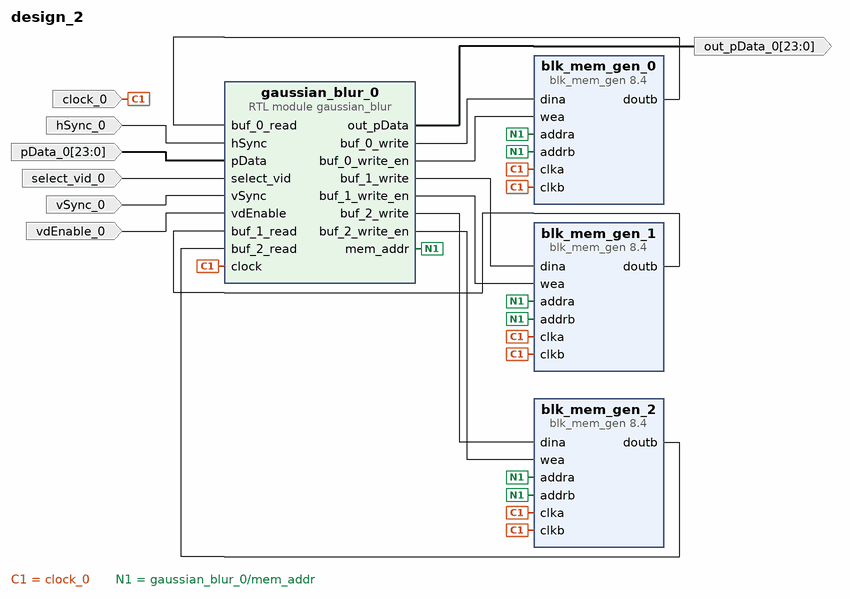
[diagram p0: block diagram of the top level]
# Vivado block design design_2, xc7z020clg400-1, Vivado 2021.2
create_bd_design design_2

create_bd_port -dir I hSync_0
create_bd_port -dir I vSync_0
create_bd_port -dir I vdEnable_0
create_bd_port -dir I -from 23 -to 0 pData_0
create_bd_port -dir O -from 23 -to 0 out_pData_0
create_bd_port -dir I -type clk clock_0
create_bd_port -dir I select_vid_0

create_bd_cell -type ip -vlnv xilinx.com:ip:blk_mem_gen:8.4 blk_mem_gen_0
set_property -dict [list \
  CONFIG.Enable_32bit_Address false \
  CONFIG.Enable_A Always_Enabled \
  CONFIG.Enable_B Always_Enabled \
  CONFIG.Memory_Type Simple_Dual_Port_RAM \
  CONFIG.Operating_Mode_A WRITE_FIRST \
  CONFIG.Port_B_Clock 100 \
  CONFIG.Port_B_Enable_Rate 100 \
  CONFIG.Read_Width_B 24 \
  CONFIG.Register_PortB_Output_of_Memory_Primitives true \
  CONFIG.Use_Byte_Write_Enable false \
  CONFIG.Write_Depth_A 2040 \
  CONFIG.Write_Width_A 24 \
  CONFIG.Write_Width_B 24 \
  CONFIG.use_bram_block Stand_Alone \
] [get_bd_cells blk_mem_gen_0]
create_bd_cell -type ip -vlnv xilinx.com:ip:blk_mem_gen:8.4 blk_mem_gen_1
set_property -dict [list \
  CONFIG.Enable_32bit_Address false \
  CONFIG.Enable_A Always_Enabled \
  CONFIG.Enable_B Always_Enabled \
  CONFIG.Memory_Type Simple_Dual_Port_RAM \
  CONFIG.Operating_Mode_A WRITE_FIRST \
  CONFIG.Port_B_Clock 100 \
  CONFIG.Port_B_Enable_Rate 100 \
  CONFIG.Read_Width_B 24 \
  CONFIG.Register_PortB_Output_of_Memory_Primitives true \
  CONFIG.Use_Byte_Write_Enable false \
  CONFIG.Write_Depth_A 2040 \
  CONFIG.Write_Width_A 24 \
  CONFIG.Write_Width_B 24 \
  CONFIG.use_bram_block Stand_Alone \
] [get_bd_cells blk_mem_gen_1]
create_bd_cell -type ip -vlnv xilinx.com:ip:blk_mem_gen:8.4 blk_mem_gen_2
set_property -dict [list \
  CONFIG.Enable_32bit_Address false \
  CONFIG.Enable_A Always_Enabled \
  CONFIG.Enable_B Always_Enabled \
  CONFIG.Memory_Type Simple_Dual_Port_RAM \
  CONFIG.Operating_Mode_A WRITE_FIRST \
  CONFIG.Port_B_Clock 100 \
  CONFIG.Port_B_Enable_Rate 100 \
  CONFIG.Read_Width_B 24 \
  CONFIG.Register_PortB_Output_of_Memory_Primitives true \
  CONFIG.Use_Byte_Write_Enable false \
  CONFIG.Write_Depth_A 2040 \
  CONFIG.Write_Width_A 24 \
  CONFIG.Write_Width_B 24 \
  CONFIG.use_bram_block Stand_Alone \
] [get_bd_cells blk_mem_gen_2]
create_bd_cell -type module -reference gaussian_blur gaussian_blur_0

# ---- connections ----

connect_bd_net [get_bd_pins blk_mem_gen_0/doutb] [get_bd_pins gaussian_blur_0/buf_0_read]
connect_bd_net [get_bd_pins blk_mem_gen_1/doutb] [get_bd_pins gaussian_blur_0/buf_1_read]
connect_bd_net [get_bd_pins blk_mem_gen_2/doutb] [get_bd_pins gaussian_blur_0/buf_2_read]
connect_bd_net -net clock_0_1 [get_bd_ports clock_0] \
  [get_bd_pins blk_mem_gen_0/clka] [get_bd_pins blk_mem_gen_0/clkb] [get_bd_pins blk_mem_gen_1/clka] \
  [get_bd_pins blk_mem_gen_1/clkb] [get_bd_pins blk_mem_gen_2/clka] [get_bd_pins blk_mem_gen_2/clkb] \
  [get_bd_pins gaussian_blur_0/clock]
connect_bd_net [get_bd_pins gaussian_blur_0/buf_0_write] [get_bd_pins blk_mem_gen_0/dina]
connect_bd_net [get_bd_pins gaussian_blur_0/buf_0_write_en] [get_bd_pins blk_mem_gen_0/wea]
connect_bd_net [get_bd_pins gaussian_blur_0/buf_1_write] [get_bd_pins blk_mem_gen_1/dina]
connect_bd_net [get_bd_pins gaussian_blur_0/buf_1_write_en] [get_bd_pins blk_mem_gen_1/wea]
connect_bd_net [get_bd_pins gaussian_blur_0/buf_2_write] [get_bd_pins blk_mem_gen_2/dina]
connect_bd_net [get_bd_pins gaussian_blur_0/buf_2_write_en] [get_bd_pins blk_mem_gen_2/wea]
connect_bd_net [get_bd_pins gaussian_blur_0/mem_addr] \
  [get_bd_pins blk_mem_gen_0/addra] [get_bd_pins blk_mem_gen_1/addra] [get_bd_pins blk_mem_gen_1/addrb] \
  [get_bd_pins blk_mem_gen_0/addrb] [get_bd_pins blk_mem_gen_2/addra] [get_bd_pins blk_mem_gen_2/addrb]
connect_bd_net [get_bd_pins gaussian_blur_0/out_pData] [get_bd_ports out_pData_0]
connect_bd_net -net hSync_0_1 [get_bd_ports hSync_0] [get_bd_pins gaussian_blur_0/hSync]
connect_bd_net -net pData_0_1 [get_bd_ports pData_0] [get_bd_pins gaussian_blur_0/pData]
connect_bd_net -net select_vid_0_1 [get_bd_ports select_vid_0] [get_bd_pins gaussian_blur_0/select_vid]
connect_bd_net -net vSync_0_1 [get_bd_ports vSync_0] [get_bd_pins gaussian_blur_0/vSync]
connect_bd_net -net vdEnable_0_1 [get_bd_ports vdEnable_0] [get_bd_pins gaussian_blur_0/vdEnable]

validate_bd_design
save_bd_design
